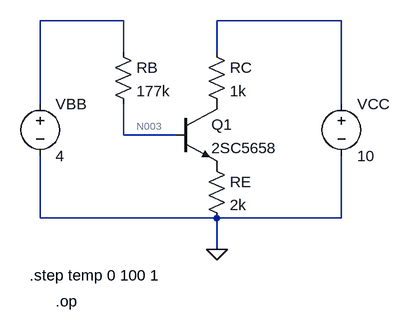
[diagram p0: schematic cirConRE.asc]
cirConRE.asc, the LTspice schematic file:
Version 4.1
SHEET 1 880 680
WIRE 64 -16 -64 -16
WIRE 400 -16 208 -16
WIRE 64 32 64 -16
WIRE 208 32 208 -16
WIRE -64 112 -64 -16
WIRE 400 112 400 -16
WIRE 64 160 64 112
WIRE 144 160 64 160
WIRE -64 288 -64 192
WIRE 208 288 -64 288
WIRE 400 288 400 192
WIRE 400 288 208 288
WIRE 208 336 208 288
FLAG 208 336 0
SYMBOL npn 144 112 R0
SYMATTR InstName Q1
SYMATTR Value 2SC5658
SYMBOL res 192 16 R0
SYMATTR InstName RC
SYMATTR Value 1k
SYMBOL res 48 16 R0
SYMATTR InstName RB
SYMATTR Value 177k
SYMBOL voltage -64 96 R0
WINDOW 123 0 0 Left 0
WINDOW 39 0 0 Left 0
SYMATTR InstName VBB
SYMATTR Value 4
SYMBOL voltage 400 96 R0
WINDOW 123 0 0 Left 0
WINDOW 39 0 0 Left 0
SYMATTR InstName VCC
SYMATTR Value 10
SYMBOL res 192 192 R0
SYMATTR InstName RE
SYMATTR Value 2k
TEXT -80 376 Left 2 !.step temp 0 100 1
TEXT -40 416 Left 2 !.op

The netlist it stands for:
* cirConRE.asc
Q1 P001 N003 P002 0 2SC5658
RC N002 P001 1k
RB N001 N003 177k
VBB N001 0 4
VCC N002 0 10
RE P002 0 2k
.model NPN NPN
.model PNP PNP
.lib standard.bjt
.step temp 0 100 1
.op
.backanno
.end

* Results of the author's LTspice run, read from the files saved beside the schematic
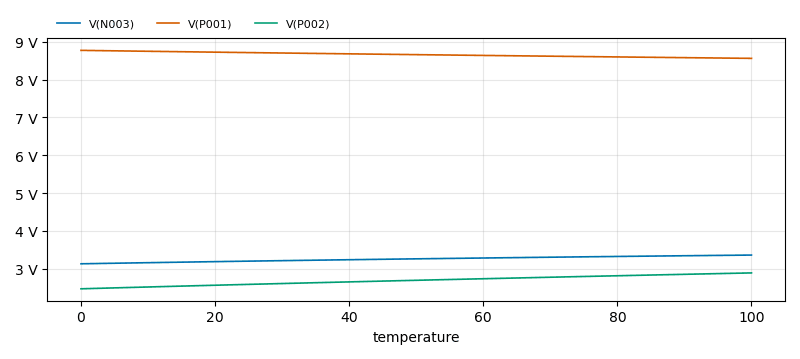
[diagram p1: Operating Point of cirConRE.asc, plotted from the saved traces]
* Operating Point, 1 run:
*   V(N003): 3.128 V at temperature=0, 3.359 V at temperature=100 , min 3.128 V, max 3.359 V
*   V(P001): 8.771 V at temperature=0, 8.56 V at temperature=100 , min 8.56 V, max 8.771 V
*   V(P002): 2.467 V at temperature=0, 2.887 V at temperature=100 , min 2.467 V, max 2.887 V